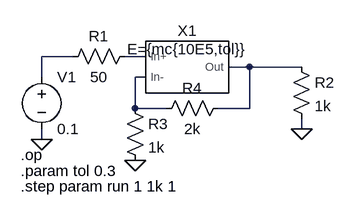
[diagram p0: schematic Lab4.asc]
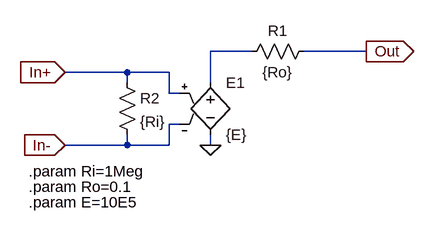
[diagram p1: sub-circuit vcvs_model.asc]
Lab4.asc, the LTspice schematic file:
Version 4
SHEET 1 880 680
WIRE -272 112 -320 112
WIRE -160 112 -192 112
WIRE 0 128 -32 128
WIRE 80 128 0 128
WIRE -320 144 -320 112
WIRE -160 144 -176 144
WIRE -176 192 -176 144
WIRE -128 192 -176 192
WIRE 0 192 0 128
WIRE 0 192 -48 192
WIRE 80 224 80 208
WIRE -320 240 -320 224
FLAG -320 240 0
FLAG 80 224 0
FLAG -176 272 0
SYMBOL res -176 96 R90
WINDOW 0 0 56 VBottom 2
WINDOW 3 32 56 VTop 2
SYMATTR InstName R1
SYMATTR Value 50
SYMBOL voltage -320 128 R0
SYMATTR InstName V1
SYMATTR Value 0.1
SYMBOL res 64 112 R0
SYMATTR InstName R2
SYMATTR Value 1k
SYMBOL VCVS_Model -96 128 R0
WINDOW 39 0 -12 Bottom 2
SYMATTR SpiceLine E={mc{10E5,tol}}
SYMATTR InstName X1
SYMBOL res -192 176 R0
SYMATTR InstName R3
SYMATTR Value 1k
SYMBOL res -32 176 R90
WINDOW 0 0 56 VBottom 2
WINDOW 3 32 56 VTop 2
SYMATTR InstName R4
SYMATTR Value 2k
TEXT -352 264 Left 2 !.op
TEXT -352 288 Left 2 !.param tol 0.3
TEXT -352 312 Left 2 !.step param run 1 1k 1

vcvs_model.asc, the sub-circuit schematic file:
Version 4
SHEET 1 880 680
WIRE 224 64 160 64
WIRE 400 64 304 64
WIRE 32 96 -64 96
WIRE 96 96 32 96
WIRE 32 112 32 96
WIRE 160 112 160 64
WIRE 96 128 96 96
WIRE 112 128 96 128
WIRE 112 176 96 176
WIRE 32 208 32 192
WIRE 32 208 -64 208
WIRE 96 208 96 176
WIRE 96 208 32 208
WIRE 160 208 160 192
FLAG 160 208 0
FLAG -64 96 In+
IOPIN -64 96 In
FLAG -64 208 In-
IOPIN -64 208 In
FLAG 400 64 Out
IOPIN 400 64 Out
SYMBOL e 160 96 R0
SYMATTR InstName E1
SYMATTR Value {E}
SYMBOL res 320 48 R90
WINDOW 0 0 56 VBottom 2
WINDOW 3 32 56 VTop 2
SYMATTR InstName R1
SYMATTR Value {Ro}
SYMBOL res 16 96 R0
SYMATTR InstName R2
SYMATTR Value {Ri}
TEXT -120 248 Left 2 !.param Ri=1Meg
TEXT -120 272 Left 2 !.param Ro=0.1
TEXT -120 296 Left 2 !.param E=10E5

The netlist it stands for:
* Lab4.asc
R1 N002 N001 50
V1 N001 0 0.1
R2 N003 0 1k
XX1 N002 N004 N003 vcvs_model params: E={mc{10E5,tol}}
R3 N004 0 1k
R4 N003 N004 2k

* block symbol definitions
.subckt vcvs_model In+ In- Out
E1 N001 0 In+ In- {E}
R1 Out N001 {Ro}
R2 In+ In- {Ri}
.param Ri=1Meg
.param Ro=0.1
.param E=10E5
.ends vcvs_model

.op
.param tol 0.3
.step param run 1 1k 1
.backanno
.end